# EAGLE design usb_breakout (EAGLE 9.6.1)
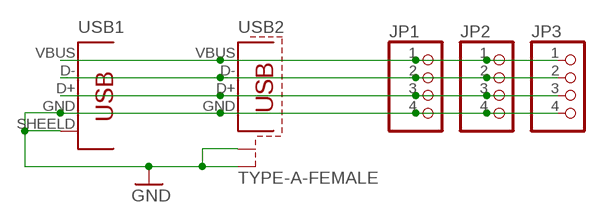
[diagram p0: schematic, sheet 1]

## Parts
JP1  PINHD-1X4  [1X04]
JP2  PINHD-1X4  [1X04]
JP3  PINHD-1X4  [1X04]
USB1  TYPE-A-MALE-SHILED  [TYPE-A-MALE]
USB2  TYPE-A-FEMALE  [TYPE-A-FEMALE]

## Nets
GND: JP1.4 JP2.4 JP3.4 USB1.GND USB1.SHEELD USB2.GND USB2.S1 USB2.S2
N$1: JP1.1 JP2.1 JP3.1 USB1.VBUS USB2.VBUS(VCC)
N$2: JP1.2 JP2.2 JP3.2 USB1.D- USB2.D-
N$3: JP1.3 JP2.3 JP3.3 USB1.D+ USB2.D+

## Library data of the parts
JP1-JP3 = pinhead:PINHD-1X4: PIN HEADER
USB1 = usb-connector:TYPE-A-MALE-SHILED
USB2 = usb-connector:TYPE-A-FEMALE; OC_FARNELL: unknown; OC_NEWARK: unknown

## Net classes
1 power: width 0.178 mm

## Board
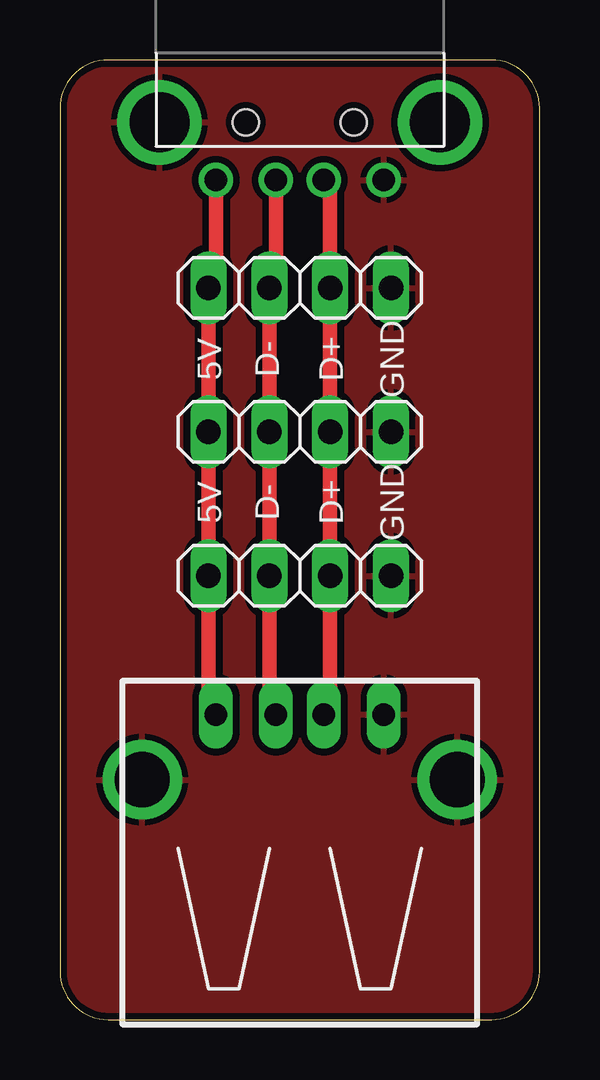
[diagram p1: board, top side]
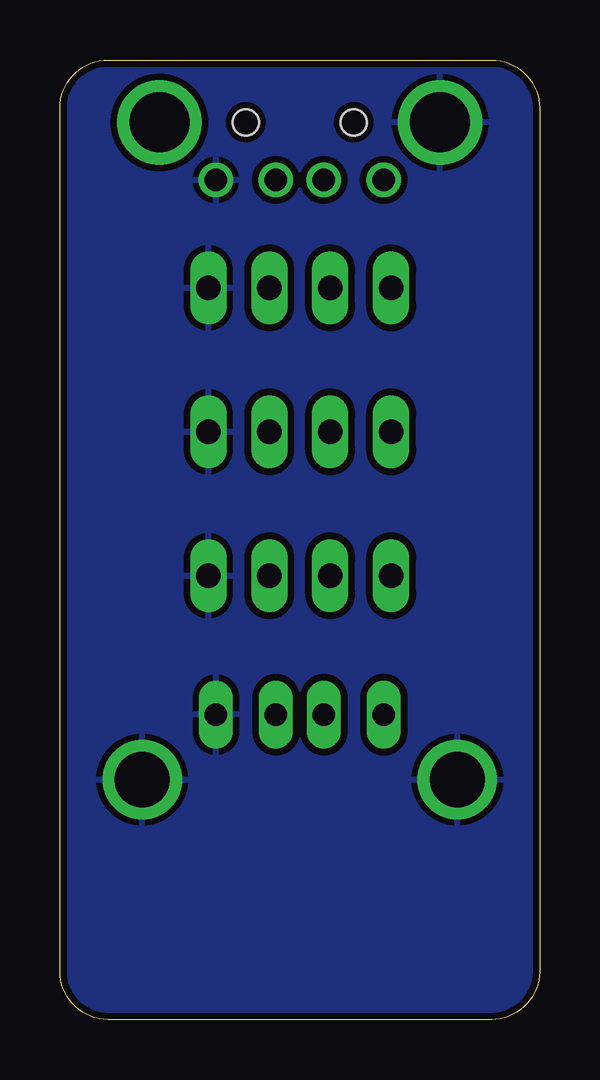
[diagram p2: board, bottom side, seen from below]

Size 20 x 40 mm. Coordinates in mm from the lower left corner, seen from the top.
Outline: 2,0 18,0 arc90 20,2 20,38 arc90 18,40 2,40 arc90 0,38 0,2 arc90 2,0
Copper layers (1*16): Top 0.035mm / dielectric 1.5mm / Bottom 0.035mm
Design rules "deku_2layer_6mil": minimum track width 6mil, minimum drill 15mil, track to track 6mil, track to pad 6mil, pad to pad 6mil, via to via 6mil, smd to smd 6mil, copper to edge 10mil, drill to drill 6mil, minimum pad ring 7mil, minimum via ring 7mil, stop-mask expansion 4mil, vias tented up to drill 25mil, thermal gap 10mil

### Footprints (pad centres in the part's own frame; a part is rotated, then mirrored left to right if it is on the bottom)
1X04 = drill 1.016 long: 1 -3.81,0; 2 -1.27,0; 3 1.27,0; 4 3.81,0
TYPE-A-MALE = drill 0.95: D+ 1,0; D- -1,0; GND 3.5,0; VBUS -3.5,0 | drill 2.5: SHEELD -5.85,2.4; SHEELD2 5.85,2.4 | hole 1.1: -2.25,2.4; 2.25,2.4
TYPE-A-FEMALE = drill 0.95 long: D+ 1,2.71; D- -1,2.71; GND 3.5,2.71; VBUS -3.5,2.71 | drill 2.3 pad 2.9: S1 -6.57,0; S2 6.57,0

### Placement (x,y rotation side)
JP1  10,30.5 0 top
JP2  10,24.5 0 top
JP3  10,18.5 0 top
USB1  10,35 0 top
USB2  10,10 0 top

### Tracks (layer width: path | path; a pad name or v marks a point on that pad's centre or on a via)
GND
  pour Top (isolate 0.279): 2,0 18,0 arc90 20,2 20,38 arc90 18,40 2,40 arc90 0,38 0,2 arc90
  pour Bottom (isolate 0.279, rank 2): 2,40 18,40 arc-90 20,38 20,2 arc-90 18,0 2,0 arc-90 0,2 0,38 arc-90
N$1
  Top 0.61: USB1.VBUS 6.5,30.81 JP1.1 JP2.1 JP3.1 6.19,13.02 USB2.VBUS
N$2
  Top 0.61: USB1.D- 9,30.77 JP1.2 JP2.2 JP3.2 8.73,12.98 USB2.D-
N$3
  Top 0.61: USB1.D+ 11.27,34.73 JP1.3 JP2.3 JP3.3 11.27,12.98 USB2.D+

### Text on the board
tNames: 5V | D- | D+ | GND | 5V | D- | D+ | GND